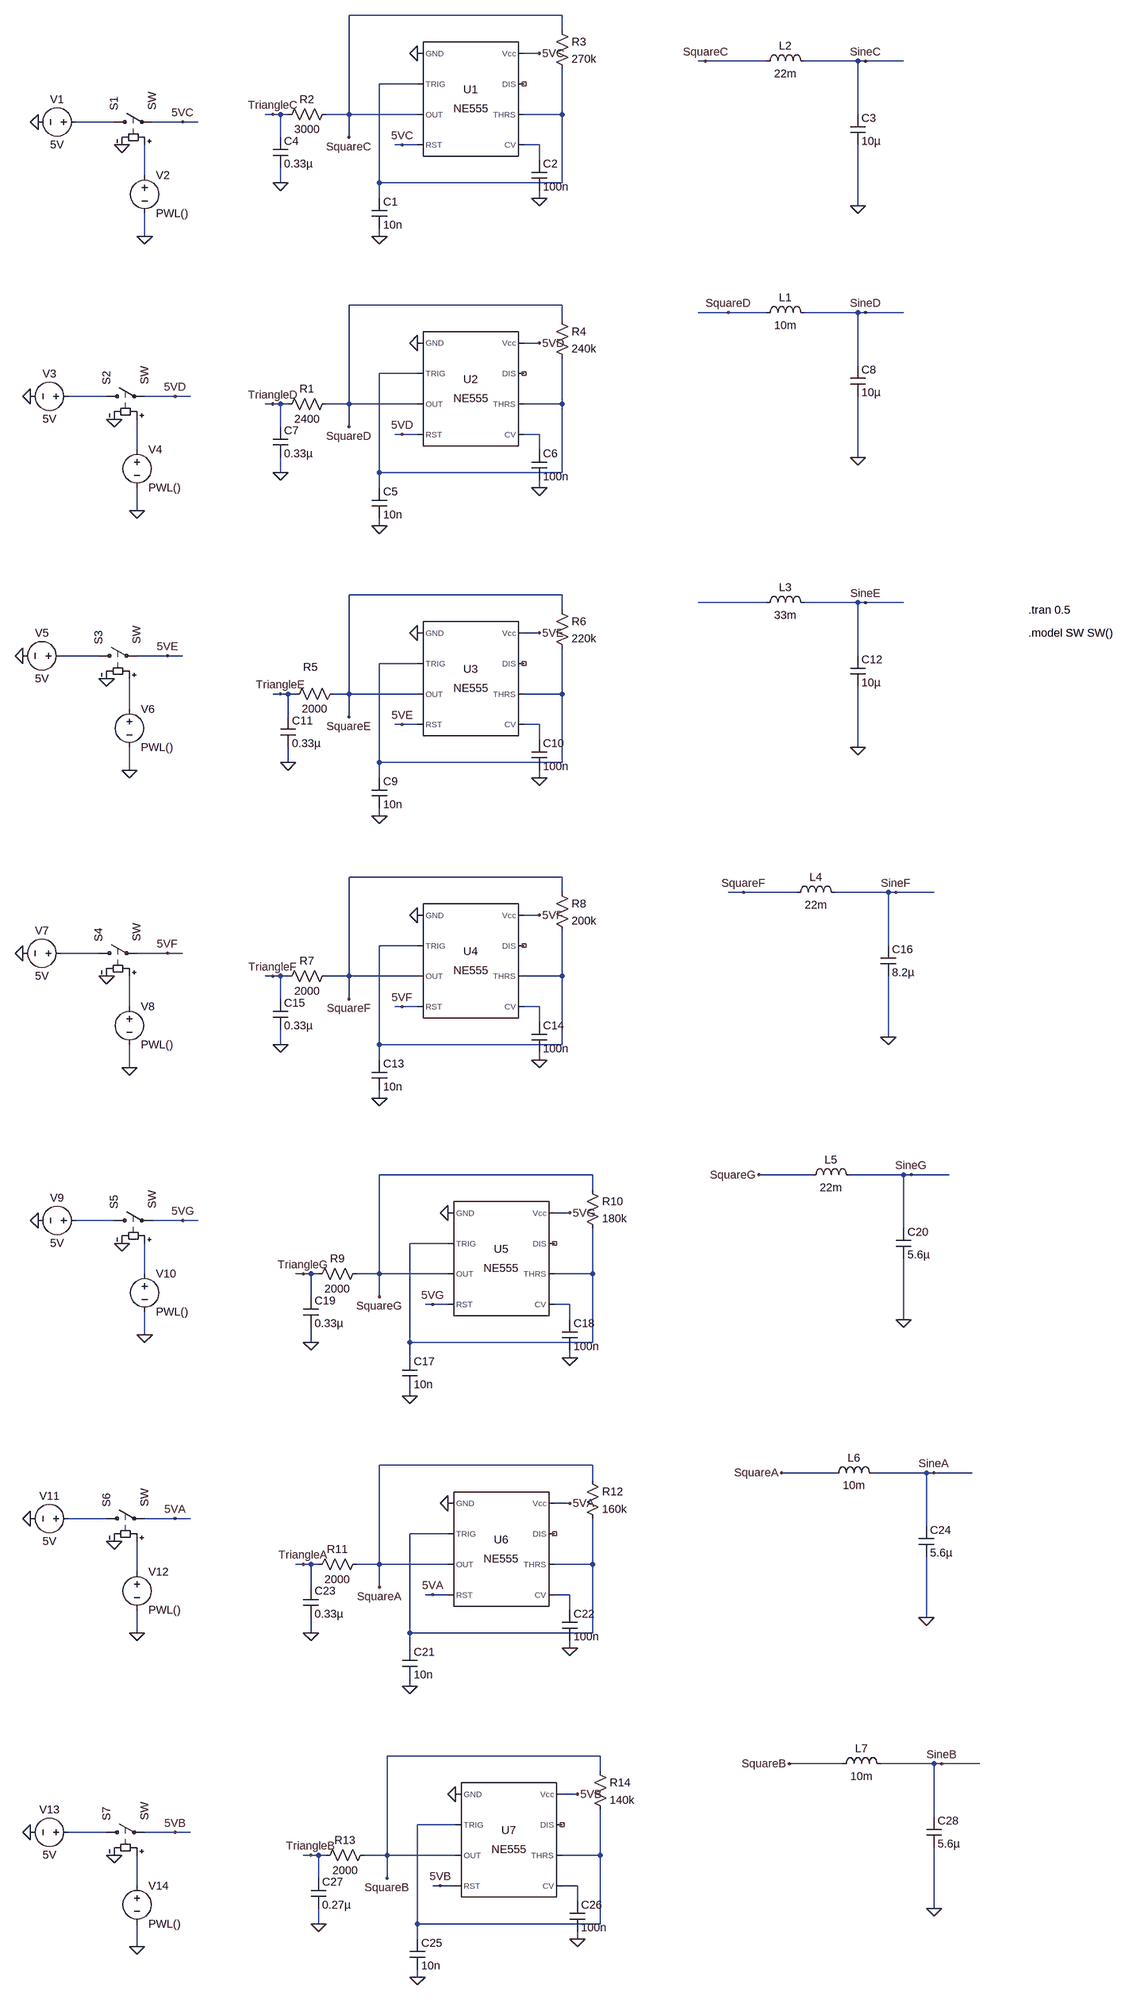
[diagram p0: schematic Keyboard + VCO.asc]
Keyboard + VCO.asc, the LTspice schematic file:
Version 4
SHEET 1 4040 4576
WIRE 640 80 192 80
WIRE 640 112 640 80
WIRE 592 160 560 160
WIRE 1328 176 1312 176
WIRE 1456 176 1328 176
WIRE 1648 176 1536 176
WIRE 1664 176 1648 176
WIRE 1744 176 1664 176
WIRE 336 224 256 224
WIRE 32 288 16 288
WIRE 48 288 32 288
WIRE 64 288 48 288
WIRE 192 288 192 80
WIRE 192 288 144 288
WIRE 336 288 192 288
WIRE 640 288 640 192
WIRE 640 288 560 288
WIRE 1648 288 1648 176
WIRE -608 304 -688 304
WIRE -464 304 -528 304
WIRE -432 304 -464 304
WIRE 48 336 48 288
WIRE 192 336 192 288
WIRE 304 352 288 352
WIRE 336 352 304 352
WIRE 592 352 560 352
WIRE 592 384 592 352
WIRE -544 416 -544 352
WIRE 48 432 48 400
WIRE 256 432 256 224
WIRE 640 432 640 288
WIRE 640 432 256 432
WIRE 256 464 256 432
WIRE 592 464 592 448
WIRE 1648 480 1648 352
WIRE -544 544 -544 496
WIRE 256 544 256 528
WIRE 640 688 192 688
WIRE 1376 704 1312 704
WIRE 1456 704 1376 704
WIRE 1648 704 1536 704
WIRE 1664 704 1648 704
WIRE 1744 704 1664 704
WIRE 640 720 640 688
WIRE 592 768 560 768
WIRE 1648 816 1648 704
WIRE 336 832 256 832
WIRE -624 880 -704 880
WIRE -480 880 -544 880
WIRE -448 880 -480 880
WIRE 32 896 16 896
WIRE 48 896 32 896
WIRE 64 896 48 896
WIRE 192 896 192 688
WIRE 192 896 144 896
WIRE 336 896 192 896
WIRE 640 896 640 800
WIRE 640 896 560 896
WIRE 48 944 48 896
WIRE 192 944 192 896
WIRE 304 960 288 960
WIRE 336 960 304 960
WIRE 592 960 560 960
WIRE -560 992 -560 928
WIRE 592 992 592 960
WIRE 1648 1008 1648 880
WIRE 48 1040 48 1008
WIRE 256 1040 256 832
WIRE 640 1040 640 896
WIRE 640 1040 256 1040
WIRE 256 1072 256 1040
WIRE 592 1072 592 1056
WIRE -560 1120 -560 1072
WIRE 256 1152 256 1136
WIRE 640 1360 192 1360
WIRE 1456 1376 1312 1376
WIRE 1648 1376 1536 1376
WIRE 1664 1376 1648 1376
WIRE 1744 1376 1664 1376
WIRE 640 1392 640 1360
WIRE 592 1440 560 1440
WIRE -640 1488 -720 1488
WIRE -496 1488 -560 1488
WIRE -464 1488 -496 1488
WIRE 1648 1488 1648 1376
WIRE 336 1504 256 1504
WIRE 48 1568 32 1568
WIRE 64 1568 48 1568
WIRE 80 1568 64 1568
WIRE 192 1568 192 1360
WIRE 192 1568 160 1568
WIRE 336 1568 192 1568
WIRE 640 1568 640 1472
WIRE 640 1568 560 1568
WIRE -576 1600 -576 1536
WIRE 64 1616 64 1568
WIRE 192 1616 192 1568
WIRE 304 1632 288 1632
WIRE 336 1632 304 1632
WIRE 592 1632 560 1632
WIRE 592 1664 592 1632
WIRE 1648 1680 1648 1552
WIRE 64 1712 64 1680
WIRE 256 1712 256 1504
WIRE 640 1712 640 1568
WIRE 640 1712 256 1712
WIRE -576 1728 -576 1680
WIRE 256 1744 256 1712
WIRE 592 1744 592 1728
WIRE 256 1824 256 1808
WIRE 640 1984 192 1984
WIRE 640 2016 640 1984
WIRE 1408 2016 1376 2016
WIRE 1520 2016 1408 2016
WIRE 1712 2016 1600 2016
WIRE 1728 2016 1712 2016
WIRE 1808 2016 1728 2016
WIRE 592 2064 560 2064
WIRE 336 2128 256 2128
WIRE 1712 2128 1712 2016
WIRE -640 2144 -720 2144
WIRE -496 2144 -560 2144
WIRE -464 2144 -496 2144
WIRE 32 2192 16 2192
WIRE 48 2192 32 2192
WIRE 64 2192 48 2192
WIRE 192 2192 192 1984
WIRE 192 2192 144 2192
WIRE 336 2192 192 2192
WIRE 640 2192 640 2096
WIRE 640 2192 560 2192
WIRE 48 2240 48 2192
WIRE 192 2240 192 2192
WIRE -576 2256 -576 2192
WIRE 304 2256 288 2256
WIRE 336 2256 304 2256
WIRE 592 2256 560 2256
WIRE 592 2288 592 2256
WIRE 1712 2320 1712 2192
WIRE 48 2336 48 2304
WIRE 256 2336 256 2128
WIRE 640 2336 640 2192
WIRE 640 2336 256 2336
WIRE 256 2368 256 2336
WIRE 592 2368 592 2352
WIRE -576 2384 -576 2336
WIRE 256 2448 256 2432
WIRE 704 2704 256 2704
WIRE 1552 2704 1440 2704
WIRE 1744 2704 1632 2704
WIRE 1760 2704 1744 2704
WIRE 1840 2704 1760 2704
WIRE 704 2736 704 2704
WIRE 656 2784 624 2784
WIRE -608 2800 -688 2800
WIRE -464 2800 -528 2800
WIRE -432 2800 -464 2800
WIRE 1744 2816 1744 2704
WIRE 400 2848 320 2848
WIRE -544 2912 -544 2848
WIRE 96 2912 80 2912
WIRE 112 2912 96 2912
WIRE 128 2912 112 2912
WIRE 256 2912 256 2704
WIRE 256 2912 208 2912
WIRE 400 2912 256 2912
WIRE 704 2912 704 2816
WIRE 704 2912 624 2912
WIRE 112 2960 112 2912
WIRE 256 2960 256 2912
WIRE 368 2976 352 2976
WIRE 400 2976 368 2976
WIRE 656 2976 624 2976
WIRE 656 3008 656 2976
WIRE 1744 3008 1744 2880
WIRE -544 3040 -544 2992
WIRE 112 3056 112 3024
WIRE 320 3056 320 2848
WIRE 704 3056 704 2912
WIRE 704 3056 320 3056
WIRE 320 3088 320 3056
WIRE 656 3088 656 3072
WIRE 320 3168 320 3152
WIRE 704 3392 256 3392
WIRE 1600 3408 1488 3408
WIRE 1792 3408 1680 3408
WIRE 1808 3408 1792 3408
WIRE 1888 3408 1808 3408
WIRE 704 3424 704 3392
WIRE 656 3472 624 3472
WIRE -624 3504 -704 3504
WIRE -480 3504 -544 3504
WIRE -448 3504 -480 3504
WIRE 1792 3520 1792 3408
WIRE 400 3536 320 3536
WIRE 96 3600 80 3600
WIRE 112 3600 96 3600
WIRE 128 3600 112 3600
WIRE 256 3600 256 3392
WIRE 256 3600 208 3600
WIRE 400 3600 256 3600
WIRE 704 3600 704 3504
WIRE 704 3600 624 3600
WIRE -560 3616 -560 3552
WIRE 112 3648 112 3600
WIRE 256 3648 256 3600
WIRE 368 3664 352 3664
WIRE 400 3664 368 3664
WIRE 656 3664 624 3664
WIRE 656 3696 656 3664
WIRE 1792 3712 1792 3584
WIRE -560 3744 -560 3696
WIRE 112 3744 112 3712
WIRE 320 3744 320 3536
WIRE 704 3744 704 3600
WIRE 704 3744 320 3744
WIRE 320 3776 320 3744
WIRE 656 3776 656 3760
WIRE 320 3856 320 3840
WIRE 720 4096 272 4096
WIRE 1616 4112 1504 4112
WIRE 1808 4112 1696 4112
WIRE 1824 4112 1808 4112
WIRE 1904 4112 1824 4112
WIRE 720 4128 720 4096
WIRE 672 4176 640 4176
WIRE 1808 4224 1808 4112
WIRE 416 4240 336 4240
WIRE -624 4256 -704 4256
WIRE -480 4256 -544 4256
WIRE -448 4256 -480 4256
WIRE 112 4304 96 4304
WIRE 128 4304 112 4304
WIRE 144 4304 128 4304
WIRE 272 4304 272 4096
WIRE 272 4304 224 4304
WIRE 416 4304 272 4304
WIRE 720 4304 720 4208
WIRE 720 4304 640 4304
WIRE 128 4352 128 4304
WIRE 272 4352 272 4304
WIRE -560 4368 -560 4304
WIRE 384 4368 368 4368
WIRE 416 4368 384 4368
WIRE 672 4368 640 4368
WIRE 672 4400 672 4368
WIRE 1808 4416 1808 4288
WIRE 128 4448 128 4416
WIRE 336 4448 336 4240
WIRE 720 4448 720 4304
WIRE 720 4448 336 4448
WIRE 336 4480 336 4448
WIRE 672 4480 672 4464
WIRE -560 4496 -560 4448
WIRE 336 4560 336 4544
FLAG 336 160 0
FLAG 256 544 0
FLAG 304 352 5VC
FLAG 592 464 0
FLAG 592 160 5VC
FLAG 48 432 0
FLAG 192 336 SquareC
FLAG 32 288 TriangleC
FLAG 1648 480 0
FLAG 1664 176 SineC
FLAG 336 768 0
FLAG 256 1152 0
FLAG 304 960 5VD
FLAG 592 1072 0
FLAG 592 768 5VD
FLAG 48 1040 0
FLAG 192 944 SquareD
FLAG 32 896 TriangleD
FLAG 1648 1008 0
FLAG 1376 704 SquareD
FLAG 1664 704 SineD
FLAG 336 1440 0
FLAG 256 1824 0
FLAG 304 1632 5VE
FLAG 592 1744 0
FLAG 592 1440 5VE
FLAG 64 1712 0
FLAG 192 1616 SquareE
FLAG 48 1568 TriangleE
FLAG 1648 1680 0
FLAG 1664 1376 SineE
FLAG 336 2064 0
FLAG 256 2448 0
FLAG 304 2256 5VF
FLAG 592 2368 0
FLAG 592 2064 5VF
FLAG 48 2336 0
FLAG 192 2240 SquareF
FLAG 32 2192 TriangleF
FLAG 1712 2320 0
FLAG 1728 2016 SineF
FLAG 1408 2016 SquareF
FLAG 400 2784 0
FLAG 320 3168 0
FLAG 368 2976 5VG
FLAG 656 3088 0
FLAG 656 2784 5VG
FLAG 112 3056 0
FLAG 256 2960 SquareG
FLAG 96 2912 TriangleG
FLAG 1744 3008 0
FLAG 1760 2704 SineG
FLAG 1440 2704 SquareG
FLAG 400 3472 0
FLAG 320 3856 0
FLAG 368 3664 5VA
FLAG 656 3776 0
FLAG 656 3472 5VA
FLAG 112 3744 0
FLAG 256 3648 SquareA
FLAG 96 3600 TriangleA
FLAG 1792 3712 0
FLAG 1808 3408 SineA
FLAG 1488 3408 SquareA
FLAG 416 4176 0
FLAG 336 4560 0
FLAG 384 4368 5VB
FLAG 672 4480 0
FLAG 672 4176 5VB
FLAG 128 4448 0
FLAG 272 4352 SquareB
FLAG 112 4304 TriangleB
FLAG 1808 4416 0
FLAG 1824 4112 SineB
FLAG 1504 4112 SquareB
FLAG -592 352 0
FLAG -544 544 0
FLAG -464 304 5VC
FLAG -768 304 0
FLAG -608 928 0
FLAG -560 1120 0
FLAG -480 880 5VD
FLAG -784 880 0
FLAG -624 1536 0
FLAG -576 1728 0
FLAG -496 1488 5VE
FLAG -800 1488 0
FLAG -624 2192 0
FLAG -576 2384 0
FLAG -496 2144 5VF
FLAG -800 2144 0
FLAG -592 2848 0
FLAG -544 3040 0
FLAG -464 2800 5VG
FLAG -768 2800 0
FLAG -608 3552 0
FLAG -560 3744 0
FLAG -480 3504 5VA
FLAG -784 3504 0
FLAG -608 4304 0
FLAG -560 4496 0
FLAG -480 4256 5VB
FLAG -784 4256 0
FLAG 1328 176 SquareC
SYMBOL Misc/NE555 448 256 R0
SYMATTR InstName U1
SYMBOL cap 240 464 R0
SYMATTR InstName C1
SYMATTR Value 10n
SYMBOL res 160 272 R90
WINDOW 0 0 56 VBottom 2
WINDOW 3 32 56 VTop 2
SYMATTR InstName R2
SYMATTR Value 3000
SYMBOL cap 576 384 R0
SYMATTR InstName C2
SYMATTR Value 100n
SYMBOL res 624 96 R0
SYMATTR InstName R3
SYMATTR Value 270k
SYMBOL cap 32 336 R0
SYMATTR InstName C4
SYMATTR Value 0.33µ
SYMBOL voltage -672 304 R90
WINDOW 0 -32 56 VBottom 2
WINDOW 3 32 56 VTop 2
SYMATTR InstName V1
SYMATTR Value 5V
SYMBOL ind 1440 192 R270
WINDOW 0 32 56 VTop 2
WINDOW 3 5 56 VBottom 2
SYMATTR InstName L2
SYMATTR Value 22m
SYMBOL cap 1632 288 R0
SYMATTR InstName C3
SYMATTR Value 10µ
SYMBOL Misc/NE555 448 864 R0
SYMATTR InstName U2
SYMBOL cap 240 1072 R0
SYMATTR InstName C5
SYMATTR Value 10n
SYMBOL res 160 880 R90
WINDOW 0 0 56 VBottom 2
WINDOW 3 32 56 VTop 2
SYMATTR InstName R1
SYMATTR Value 2400
SYMBOL cap 576 992 R0
SYMATTR InstName C6
SYMATTR Value 100n
SYMBOL res 624 704 R0
SYMATTR InstName R4
SYMATTR Value 240k
SYMBOL cap 32 944 R0
SYMATTR InstName C7
SYMATTR Value 0.33µ
SYMBOL ind 1440 720 R270
WINDOW 0 32 56 VTop 2
WINDOW 3 5 56 VBottom 2
SYMATTR InstName L1
SYMATTR Value 10m
SYMBOL cap 1632 816 R0
SYMATTR InstName C8
SYMATTR Value 10µ
SYMBOL Misc/NE555 448 1536 R0
SYMATTR InstName U3
SYMBOL cap 240 1744 R0
SYMATTR InstName C9
SYMATTR Value 10n
SYMBOL res 176 1552 R90
WINDOW 0 -25 65 VBottom 2
WINDOW 3 32 56 VTop 2
SYMATTR InstName R5
SYMATTR Value 2000
SYMBOL cap 576 1664 R0
SYMATTR InstName C10
SYMATTR Value 100n
SYMBOL res 624 1376 R0
SYMATTR InstName R6
SYMATTR Value 220k
SYMBOL cap 48 1616 R0
SYMATTR InstName C11
SYMATTR Value 0.33µ
SYMBOL ind 1440 1392 R270
WINDOW 0 32 56 VTop 2
WINDOW 3 5 56 VBottom 2
SYMATTR InstName L3
SYMATTR Value 33m
SYMBOL cap 1632 1488 R0
SYMATTR InstName C12
SYMATTR Value 10µ
SYMBOL Misc/NE555 448 2160 R0
SYMATTR InstName U4
SYMBOL cap 240 2368 R0
SYMATTR InstName C13
SYMATTR Value 10n
SYMBOL res 160 2176 R90
WINDOW 0 0 56 VBottom 2
WINDOW 3 32 56 VTop 2
SYMATTR InstName R7
SYMATTR Value 2000
SYMBOL cap 576 2288 R0
SYMATTR InstName C14
SYMATTR Value 100n
SYMBOL res 624 2000 R0
SYMATTR InstName R8
SYMATTR Value 200k
SYMBOL cap 32 2240 R0
SYMATTR InstName C15
SYMATTR Value 0.33µ
SYMBOL ind 1504 2032 R270
WINDOW 0 32 56 VTop 2
WINDOW 3 5 56 VBottom 2
SYMATTR InstName L4
SYMATTR Value 22m
SYMBOL cap 1696 2128 R0
SYMATTR InstName C16
SYMATTR Value 8.2µ
SYMBOL Misc/NE555 512 2880 R0
SYMATTR InstName U5
SYMBOL cap 304 3088 R0
SYMATTR InstName C17
SYMATTR Value 10n
SYMBOL res 224 2896 R90
WINDOW 0 0 56 VBottom 2
WINDOW 3 32 56 VTop 2
SYMATTR InstName R9
SYMATTR Value 2000
SYMBOL cap 640 3008 R0
SYMATTR InstName C18
SYMATTR Value 100n
SYMBOL res 688 2720 R0
SYMATTR InstName R10
SYMATTR Value 180k
SYMBOL cap 96 2960 R0
SYMATTR InstName C19
SYMATTR Value 0.33µ
SYMBOL ind 1536 2720 R270
WINDOW 0 32 56 VTop 2
WINDOW 3 5 56 VBottom 2
SYMATTR InstName L5
SYMATTR Value 22m
SYMBOL cap 1728 2816 R0
SYMATTR InstName C20
SYMATTR Value 5.6µ
SYMBOL Misc/NE555 512 3568 R0
SYMATTR InstName U6
SYMBOL cap 304 3776 R0
SYMATTR InstName C21
SYMATTR Value 10n
SYMBOL res 224 3584 R90
WINDOW 0 0 56 VBottom 2
WINDOW 3 32 56 VTop 2
SYMATTR InstName R11
SYMATTR Value 2000
SYMBOL cap 640 3696 R0
SYMATTR InstName C22
SYMATTR Value 100n
SYMBOL res 688 3408 R0
SYMATTR InstName R12
SYMATTR Value 160k
SYMBOL cap 96 3648 R0
SYMATTR InstName C23
SYMATTR Value 0.33µ
SYMBOL ind 1584 3424 R270
WINDOW 0 32 56 VTop 2
WINDOW 3 5 56 VBottom 2
SYMATTR InstName L6
SYMATTR Value 10m
SYMBOL cap 1776 3520 R0
SYMATTR InstName C24
SYMATTR Value 5.6µ
SYMBOL Misc/NE555 528 4272 R0
SYMATTR InstName U7
SYMBOL cap 320 4480 R0
SYMATTR InstName C25
SYMATTR Value 10n
SYMBOL res 240 4288 R90
WINDOW 0 0 56 VBottom 2
WINDOW 3 32 56 VTop 2
SYMATTR InstName R13
SYMATTR Value 2000
SYMBOL cap 656 4400 R0
SYMATTR InstName C26
SYMATTR Value 100n
SYMBOL res 704 4112 R0
SYMATTR InstName R14
SYMATTR Value 140k
SYMBOL cap 112 4352 R0
SYMATTR InstName C27
SYMATTR Value 0.27µ
SYMBOL ind 1600 4128 R270
WINDOW 0 32 56 VTop 2
WINDOW 3 5 56 VBottom 2
SYMATTR InstName L7
SYMATTR Value 10m
SYMBOL cap 1792 4224 R0
SYMATTR InstName C28
SYMATTR Value 5.6µ
SYMBOL sw -624 304 R270
SYMATTR InstName S1
SYMBOL voltage -688 880 R90
WINDOW 0 -32 56 VBottom 2
WINDOW 3 32 56 VTop 2
SYMATTR InstName V3
SYMATTR Value 5V
SYMBOL sw -640 880 R270
SYMATTR InstName S2
SYMBOL voltage -560 976 R0
SYMATTR InstName V4
SYMATTR Value PWL()
SYMBOL voltage -704 1488 R90
WINDOW 0 -32 56 VBottom 2
WINDOW 3 32 56 VTop 2
SYMATTR InstName V5
SYMATTR Value 5V
SYMBOL sw -656 1488 R270
SYMATTR InstName S3
SYMBOL voltage -576 1584 R0
SYMATTR InstName V6
SYMATTR Value PWL()
SYMBOL voltage -704 2144 R90
WINDOW 0 -32 56 VBottom 2
WINDOW 3 32 56 VTop 2
SYMATTR InstName V7
SYMATTR Value 5V
SYMBOL sw -656 2144 R270
SYMATTR InstName S4
SYMBOL voltage -576 2240 R0
SYMATTR InstName V8
SYMATTR Value PWL()
SYMBOL voltage -672 2800 R90
WINDOW 0 -32 56 VBottom 2
WINDOW 3 32 56 VTop 2
SYMATTR InstName V9
SYMATTR Value 5V
SYMBOL sw -624 2800 R270
SYMATTR InstName S5
SYMBOL voltage -544 2896 R0
SYMATTR InstName V10
SYMATTR Value PWL()
SYMBOL voltage -688 3504 R90
WINDOW 0 -32 56 VBottom 2
WINDOW 3 32 56 VTop 2
SYMATTR InstName V11
SYMATTR Value 5V
SYMBOL sw -640 3504 R270
SYMATTR InstName S6
SYMBOL voltage -560 3600 R0
SYMATTR InstName V12
SYMATTR Value PWL()
SYMBOL voltage -688 4256 R90
WINDOW 0 -32 56 VBottom 2
WINDOW 3 32 56 VTop 2
SYMATTR InstName V13
SYMATTR Value 5V
SYMBOL sw -640 4256 R270
SYMATTR InstName S7
SYMBOL voltage -560 4352 R0
SYMATTR InstName V14
SYMATTR Value PWL()
SYMBOL voltage -544 400 R0
SYMATTR InstName V2
SYMATTR Value PWL()
TEXT 2280 1392 Left 2 !.tran 0.5
TEXT 2280 1440 Left 2 !.model SW SW()

The netlist it stands for:
* Keyboard + VCO.asc
XU1 0 N001 SquareC 5VC N003 N001 NC_01 5VC NE555  ; pins GND TRIG OUT RST CV THRS DIS Vcc
C1 N001 0 10n
R2 SquareC TriangleC 3000
C2 N003 0 100n
R3 SquareC N001 270k
C4 TriangleC 0 0.33µ
V1 N002 0 5V
L2 SquareC SineC 22m
C3 SineC 0 10µ
XU2 0 N005 SquareD 5VD N007 N005 NC_02 5VD NE555  ; pins GND TRIG OUT RST CV THRS DIS Vcc
C5 N005 0 10n
R1 SquareD TriangleD 2400
C6 N007 0 100n
R4 SquareD N005 240k
C7 TriangleD 0 0.33µ
L1 SquareD SineD 10m
C8 SineD 0 10µ
XU3 0 N011 SquareE 5VE N013 N011 NC_03 5VE NE555  ; pins GND TRIG OUT RST CV THRS DIS Vcc
C9 N011 0 10n
R5 SquareE TriangleE 2000
C10 N013 0 100n
R6 SquareE N011 220k
C11 TriangleE 0 0.33µ
L3 N009 SineE 33m
C12 SineE 0 10µ
XU4 0 N014 SquareF 5VF N017 N014 NC_04 5VF NE555  ; pins GND TRIG OUT RST CV THRS DIS Vcc
C13 N014 0 10n
R7 SquareF TriangleF 2000
C14 N017 0 100n
R8 SquareF N014 200k
C15 TriangleF 0 0.33µ
L4 SquareF SineF 22m
C16 SineF 0 8.2µ
XU5 0 N019 SquareG 5VG N021 N019 NC_05 5VG NE555  ; pins GND TRIG OUT RST CV THRS DIS Vcc
C17 N019 0 10n
R9 SquareG TriangleG 2000
C18 N021 0 100n
R10 SquareG N019 180k
C19 TriangleG 0 0.33µ
L5 SquareG SineG 22m
C20 SineG 0 5.6µ
XU6 0 N023 SquareA 5VA N025 N023 NC_06 5VA NE555  ; pins GND TRIG OUT RST CV THRS DIS Vcc
C21 N023 0 10n
R11 SquareA TriangleA 2000
C22 N025 0 100n
R12 SquareA N023 160k
C23 TriangleA 0 0.33µ
L6 SquareA SineA 10m
C24 SineA 0 5.6µ
XU7 0 N026 SquareB 5VB N029 N026 NC_07 5VB NE555  ; pins GND TRIG OUT RST CV THRS DIS Vcc
C25 N026 0 10n
R13 SquareB TriangleB 2000
C26 N029 0 100n
R14 SquareB N026 140k
C27 TriangleB 0 0.27µ
L7 SquareB SineB 10m
C28 SineB 0 5.6µ
S1 N002 5VC N004 0 SW
V3 N006 0 5V
S2 N006 5VD N008 0 SW
V4 N008 0 PWL()
V5 N010 0 5V
S3 N010 5VE N012 0 SW
V6 N012 0 PWL()
V7 N015 0 5V
S4 N015 5VF N016 0 SW
V8 N016 0 PWL()
V9 N018 0 5V
S5 N018 5VG N020 0 SW
V10 N020 0 PWL()
V11 N022 0 5V
S6 N022 5VA N024 0 SW
V12 N024 0 PWL()
V13 N027 0 5V
S7 N027 5VB N028 0 SW
V14 N028 0 PWL()
V2 N004 0 PWL()
.tran 0.5
.model SW SW()
.lib NE555.sub
.backanno
.end